# EasyEDA schematic SCH_Weather-sensor_2024-05-27.json
TITLE: Sheet_1; REV: 1.0; Date: 2024-05-14; Sheet: 1/1; Drawn By: RLiao24; Company: Your Company
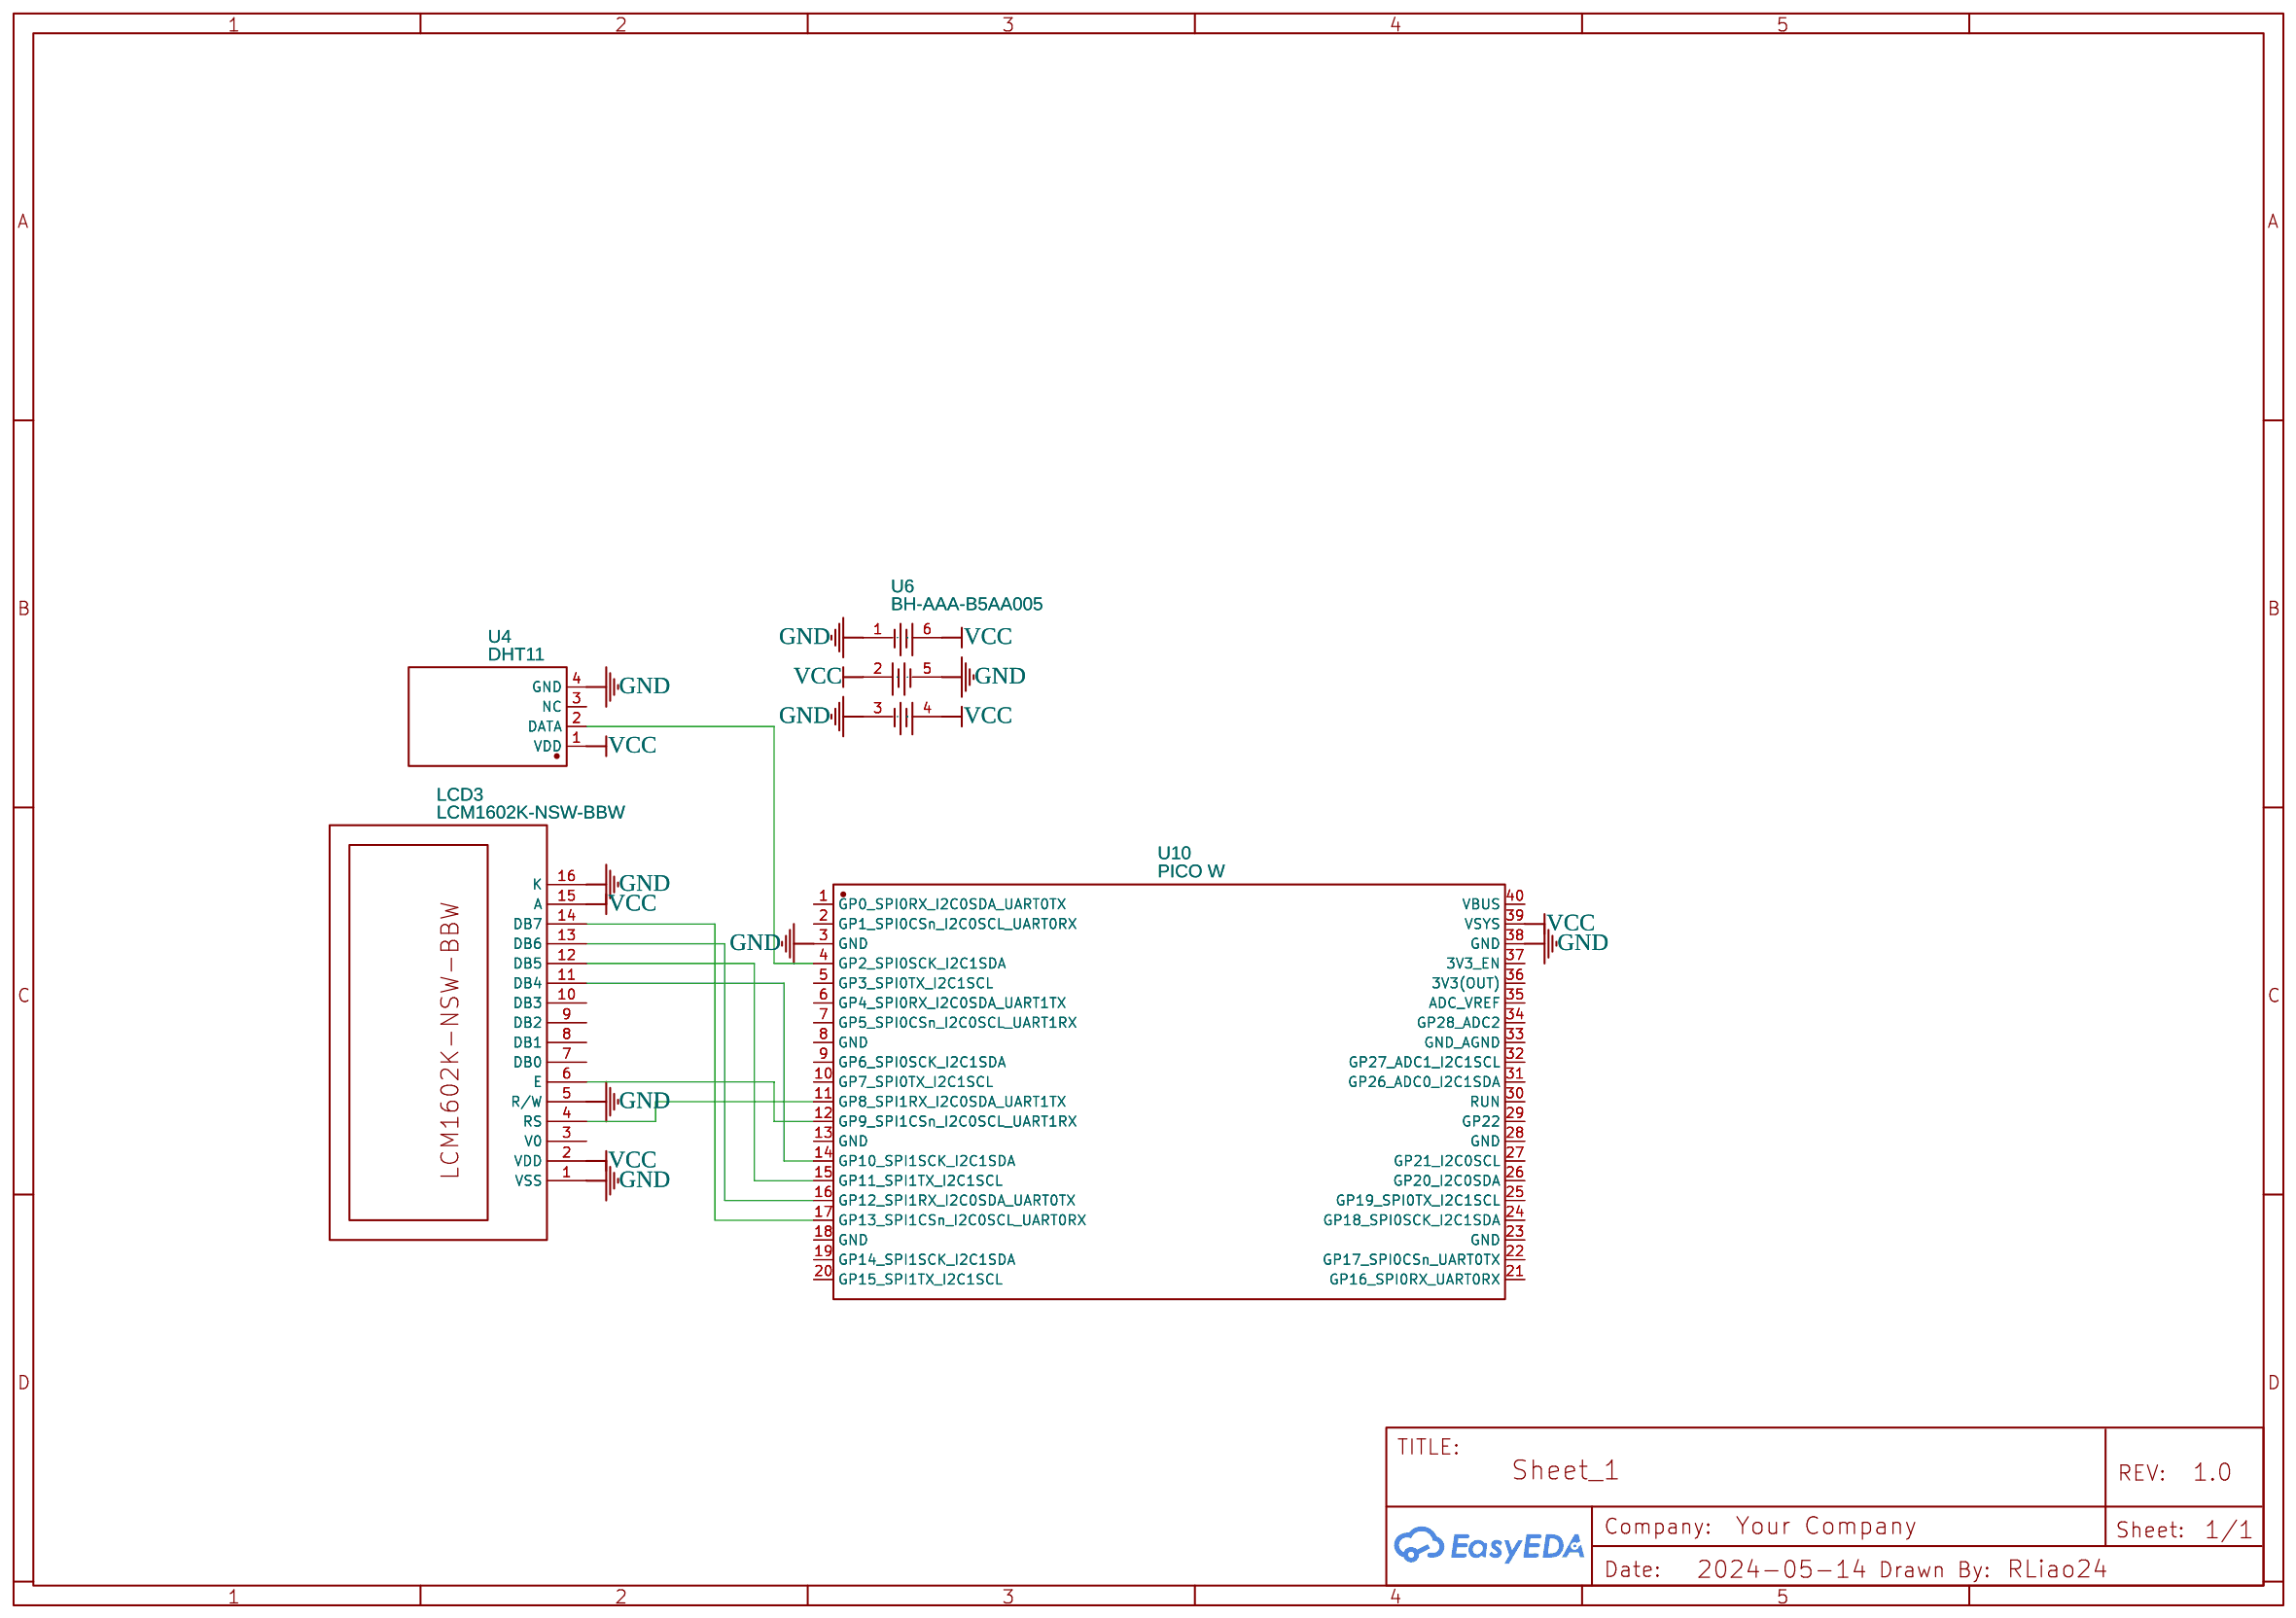
[diagram p0: schematic sheet]

## Parts
LCD3  LCM1602K-NSW-BBW  [MODULE-TH_LCM1602K]
U4  DHT11  [SENSOR-TH_DHT11]
U6  BH-AAA-B5AA005  [BAT-SMD_BH-AAA-B5AA005]
U10  PICO W  [LCC-40_L51.0-W21.0-P2.54-BL_RP2040-BASED]

## Library data of the parts
LCD3 = LCM1602K-NSW-BBW: Supplier: LCSC; Manufacturer: LONTECH(厦门龙特); Supplier Part: C83275; JLCPCB Part Class: Extended Part
U4 = DHT11: Contributor: LCSC; Supplier: LCSC; Supplier Part: C117051; Manufacturer: 广州奥松; JLCPCB Part Class: Extended Part
U6 = BH-AAA-B5AA005: Contributor: lcsc; Supplier: LCSC; Supplier Part: C2979170; Manufacturer: MYOUNG(美阳); JLCPCB Part Class: Extended Part
U10 = PICO W: Supplier: LCSC; Supplier Part: C7203003; Manufacturer: Raspberry Pi(树莓派); Contributor: lcsc; JLCPCB Part Class: Extended Part

## Nets
GND: LCD3.1(VSS) LCD3.5(R/W) LCD3.16(K) U4.4(GND) U6.1(-) U6.3(-) U6.5(-) U10.3(GND) U10.38(GND)
VCC: LCD3.2(VDD) LCD3.15(A) U4.1(VDD) U6.2(+) U6.4(+) U6.6(+) U10.39(VSYS)
Net-(LCD3-4): LCD3.4(RS) U10.11(GP8_SPI1RX_I2C0SDA_UART1TX)
Net-(LCD3-6): LCD3.6(E) U10.12(GP9_SPI1CSn_I2C0SCL_UART1RX)
Net-(LCD3-11): LCD3.11(DB4) U10.14(GP10_SPI1SCK_I2C1SDA)
Net-(LCD3-12): LCD3.12(DB5) U10.15(GP11_SPI1TX_I2C1SCL)
Net-(LCD3-13): LCD3.13(DB6) U10.16(GP12_SPI1RX_I2C0SDA_UART0TX)
Net-(LCD3-14): LCD3.14(DB7) U10.17(GP13_SPI1CSn_I2C0SCL_UART0RX)
Net-(U4-2): U4.2(DATA) U10.4(GP2_SPI0SCK_I2C1SDA)

Not connected (* = marked no-connect by the designer): LCD3 3(V0) 7(DB0) 8(DB1) 9(DB2) 10(DB3); U4 3(NC); U10 1(GP0_SPI0RX_I2C0SDA_UART0TX) 2(GP1_SPI0CSn_I2C0SCL_UART0RX) 5(GP3_SPI0TX_I2C1SCL) 6(GP4_SPI0RX_I2C0SDA_UART1TX) 7(GP5_SPI0CSn_I2C0SCL_UART1RX) 8(GND) 9(GP6_SPI0SCK_I2C1SDA) 10(GP7_SPI0TX_I2C1SCL) 13(GND) 18(GND) 19(GP14_SPI1SCK_I2C1SDA) 20(GP15_SPI1TX_I2C1SCL) 21(GP16_SPI0RX_UART0RX) 22(GP17_SPI0CSn_UART0TX) 23(GND) 24(GP18_SPI0SCK_I2C1SDA) 25(GP19_SPI0TX_I2C1SCL) 26(GP20_I2C0SDA) 27(GP21_I2C0SCL) 28(GND) 29(GP22) 30(RUN) 31(GP26_ADC0_I2C1SDA) 32(GP27_ADC1_I2C1SCL) 33(GND_AGND) 34(GP28_ADC2) 35(ADC_VREF) 36(3V3(OUT)) 37(3V3_EN) 40(VBUS)
